# EAGLE schematic yuniminMotorBoard (EAGLE 4.11)
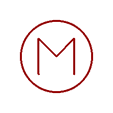
[diagram p0: schematic, sheet 1]

## Parts
U$1  MOTORGW8FRONT  [GW8L_FRONT]

## Library data of the parts
U$1 = motors:MOTORGW8